# Altium schematic sheet ADC_1.SchDoc
size 420 x 297 mm; SheetNumber: 4; SheetTotal: 13
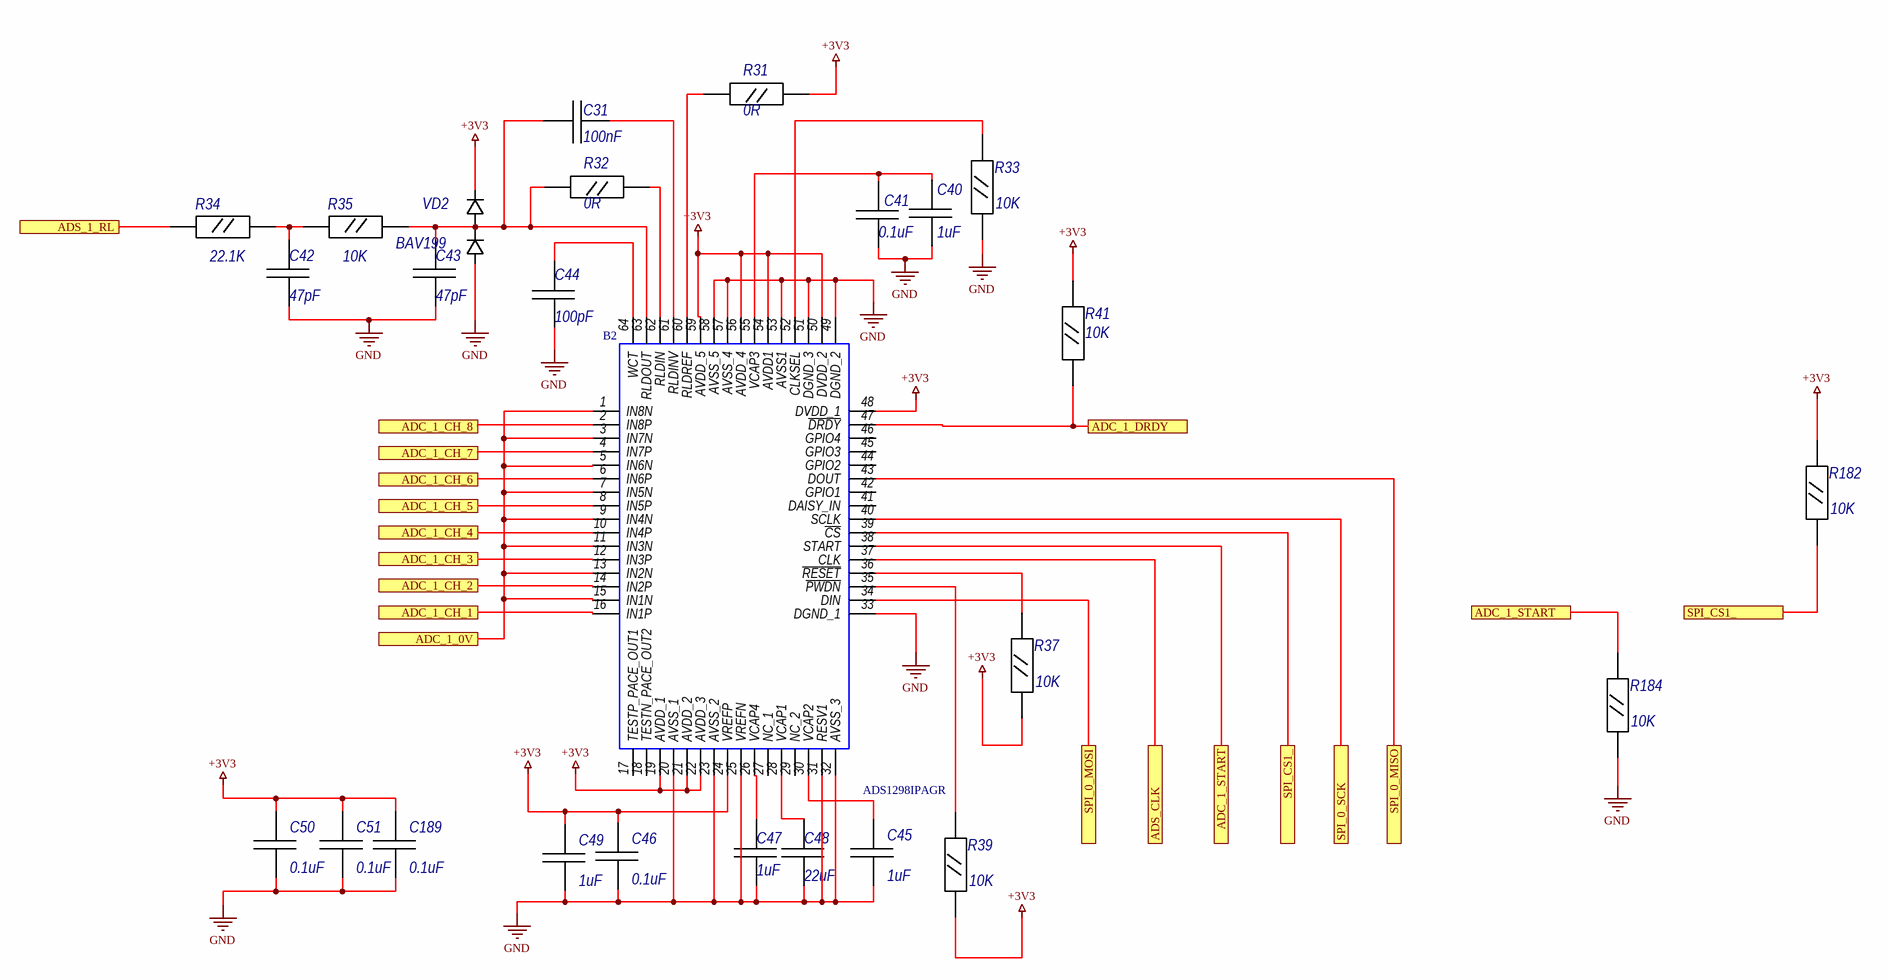
[diagram p0: ADC_1.SchDoc]

## Parts
B2  ADS1298IPAGR  [QFP50P1200X1200X120-64N]
C31  100nF  [C0603]
C40  1uF  [C0603]
C41  0.1uF  [C0603]
C42  47pF  [C0603]
C43  47pF  [C0603]
C44  100pF  [C0603]
C45  1uF  [C0603]
C46  0.1uF  [C0603]
C47  1uF  [C0603]
C48  22uF  [C0603]
C49  1uF  [C0603]
C50  0.1uF  [C0603]
C51  0.1uF  [C0603]
C189  0.1uF  [C0603]
R31  0R  [R0603]
R32  0R  [R0603]
R33  10K  [R0603]
R34  22.1K  [R0603]
R35  10K  [R0603]
R37  10K  [R0603]
R39  10K  [R0603]
R41  10K  [R0603]
R182  10K  [R0603]
R184  10K  [R0603]
VD2  BAV199  [SOT23]

## Ports
ADC_1_0V, ADC_1_CH_1, ADC_1_CH_2, ADC_1_CH_3, ADC_1_CH_4, ADC_1_CH_5, ADC_1_CH_6, ADC_1_CH_7, ADC_1_CH_8, ADC_1_DRDY, ADC_1_START, ADS_1_RL, ADS_CLK, SPI_0_MISO, SPI_0_MOSI, SPI_0_SCK, SPI_CS1_

## Nets
+3V3: B2.19(AVDD_1) B2.21(AVDD_2) B2.22(AVDD_3) B2.24(VREFP) B2.48(DVDD_1) B2.50(DVDD_2) B2.54(AVDD1) B2.56(AVDD_4) B2.59(AVDD_5) C46.2 C49.2 C50.2 C51.2 C189.2 R31.1 R37.1 R39.1 R41.2 R182.2 VD2.2
GND: B2.20(AVSS_1) B2.23(AVSS_2) B2.25(VREFN) B2.31(RESV1) B2.32(AVSS_3) B2.33(DGND_1) B2.49(DGND_2) B2.51(DGND_3) B2.53(AVSS1) B2.57(AVSS_4) B2.58(AVSS_5) C40.1 C41.1 C42.1 C43.1 C44.1 C45.1 C46.1 C47.1 C48.1 C49.1 C50.1 C51.1 C189.1 R33.1 R184.1 VD2.1
ADC_1_0V: B2.1(IN8N) B2.3(IN7N) B2.5(IN6N) B2.7(IN5N) B2.9(IN4N) B2.11(IN3N) B2.13(IN2N) B2.15(IN1N) ; port ADC_1_0V
ADC_1_CH_1: B2.16(IN1P) ; port ADC_1_CH_1
ADC_1_CH_2: B2.14(IN2P) ; port ADC_1_CH_2
ADC_1_CH_3: B2.12(IN3P) ; port ADC_1_CH_3
ADC_1_CH_4: B2.10(IN4P) ; port ADC_1_CH_4
ADC_1_CH_5: B2.8(IN5P) ; port ADC_1_CH_5
ADC_1_CH_6: B2.6(IN6P) ; port ADC_1_CH_6
ADC_1_CH_7: B2.4(IN7P) ; port ADC_1_CH_7
ADC_1_CH_8: B2.2(IN8P) ; port ADC_1_CH_8
ADC_1_DRDY: B2.47(~{DRDY}) R41.1 ; port ADC_1_DRDY
ADC_1_START: B2.38(START) R184.2 ; port ADC_1_START
ADS_1_RL: R34.1 ; port ADS_1_RL
ADS_CLK: B2.37(CLK) ; port ADS_CLK
SPI_0_MISO: B2.43(DOUT) ; port SPI_0_MISO
SPI_0_MOSI: B2.34(DIN) ; port SPI_0_MOSI
SPI_0_SCK: B2.40(SCLK) ; port SPI_0_SCK
SPI_CS1_: B2.39(~{CS}) R182.1 ; port SPI_CS1_
NetB2_26: B2.26(VCAP4) C47.2
NetB2_28: B2.28(VCAP1) C48.2
NetB2_30: B2.30(VCAP2) C45.2
NetB2_35: B2.35(~{PWDN}) R39.2
NetB2_36: B2.36(~{RESET}) R37.2
NetB2_52: B2.52(CLKSEL) R33.2
NetB2_55: B2.55(VCAP3) C40.2 C41.2
NetB2_60: B2.60(RLDREF) R31.2
NetB2_61: B2.61(RLDINV) C31.1
NetB2_62: B2.62(RLDIN) R32.1
NetB2_63: B2.63(RLDOUT) C31.2 C43.2 R32.2 R35.2 VD2.3
NetB2_64: B2.64(WCT) C44.2
NetC42_2: C42.2 R34.2 R35.1

Not connected (* = marked no-connect by the designer): B2 17(TESTP_PACE_OUT1) 18(TESTN_PACE_OUT2) 27(NC_1) 29(NC_2) 41(DAISY_IN) 42(GPIO1) 44(GPIO2) 45(GPIO3) 46(GPIO4)

## Notes on the sheet
- Перв. примен.
- Справ. №
- Подп. и дата
- Инв. № дубл.
- Взам. инв. №
- Разраб.
- Изм.
- Лист
- № докум.
- Подп.
- Дата
- Лит.
- Масса
- Масштаб
- Пров.
- Т.контр.
- Листов
- Инв. № подл.
- Утв.
- Н.контр.
- 2.106-A3
- Копировал
- Формат А3

## Library data of the parts
B2 = ADS1298IPAGR: 8-Channel 24-bit ADC With Integrated ECG Front End; Manufacturer_Name: Texas Instruments; Geometry.Height: 1.2mm; Mouser Part Number: 595-ADS1298IPAGR; Mouser Price/Stock: https://www.mouser.co.uk/ProductDetail/Texas-Instruments/ADS1298IPAGR?qs=Z6FgPJT5dDSzK7JhuKfPmw%3D%3D; Manufacturer_Part_Number: ADS1298IPAGR; Datasheet Link: http://www.ti.com/lit/ds/symlink/ads1294.pdf
C31 C40-C51 C189 = CC_SMD_0603: Ceramic Capacitor SMD; Package: 0603
  C31: Value: 100nF
  C40 C45 C47 C49: Value: 1uF
  C41 C46 C50 C51 C189: Value: 0.1uF
  C42 C43: Value: 47pF
  C44: Value: 100pF
  C48: Value: 22uF
R31-R35 R37 R39 R41 R182 R184 = R0603: Resistor SMD
  R31 R32: Value: 0R
  R33 R35 R37 R39 R41 R182 R184: Value: 10K
  R34: Value: 22.1K
VD2 = DIODE_BAV199: Diod Schottky; Diode Type: Standard; Package: SOT-23; PartNumber: BAV199; Manufacturer Part Number 1: BAV199